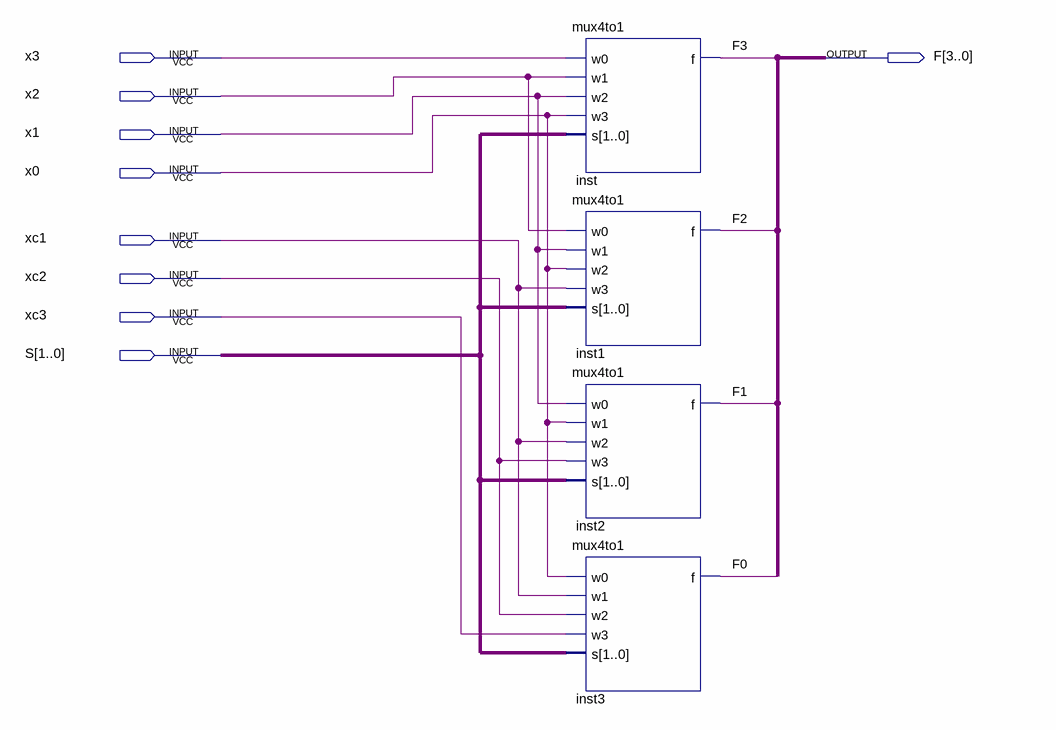
[diagram p0: schematic sheet]
// Quartus schematic lab8step2.bdf as structural Verilog: 4 symbols, 9 pins
module lab8step2 (
  input  x3,
  input  x2,
  input  x1,
  input  x0,
  input  xc1,
  input  xc2,
  input  xc3,
  input  [1:0] S,
  output [3:0] F
);

  mux4to1 inst (.w0(x3), .w1(x2), .w2(x1), .w3(x0), .s(S), .f(F[3]));
  mux4to1 inst1 (.w0(x2), .w1(x1), .w2(x0), .w3(xc1), .s(S), .f(F[2]));
  mux4to1 inst2 (.w0(x1), .w1(x0), .w2(xc1), .w3(xc2), .s(S), .f(F[1]));
  mux4to1 inst3 (.w0(x0), .w1(xc1), .w2(xc2), .w3(xc3), .s(S), .f(F[0]));
endmodule
